# EAGLE design esp-socket-3 (EAGLE 7.3.0)
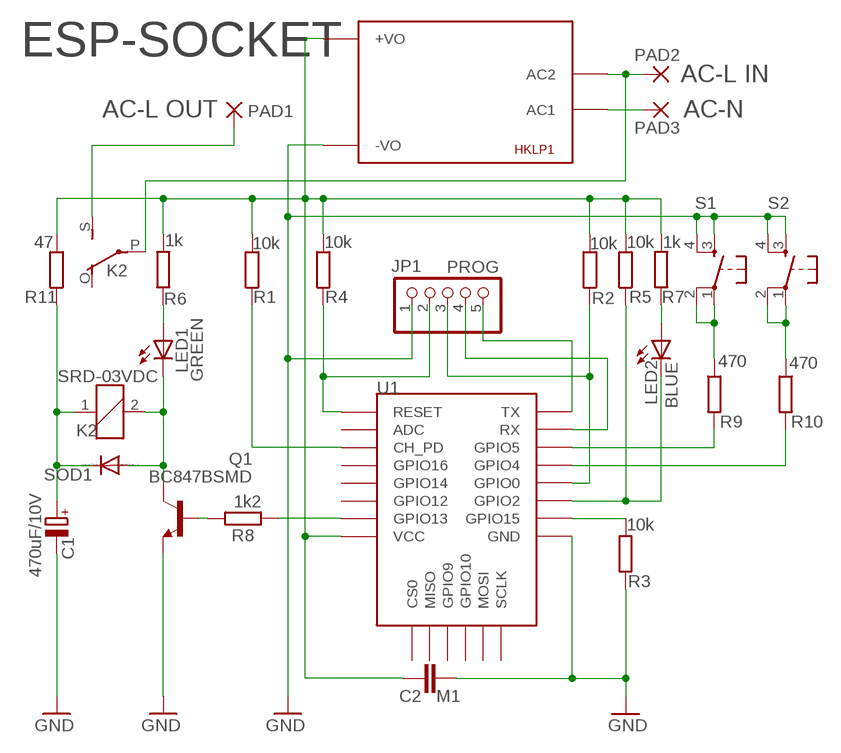
[diagram p0: schematic, sheet 1]

## Parts
C1  470uF/10V  CPOL-EUE3.5-8  [E3,5-8]
C2  M1  C-EUC1206  [C1206]
HKLP1  HKLPM01  [HKLPM01]
JP1  PROG  PINHD-1X5  [1X05]
K2  SRD-03VDC  G5LG5L-B  [G5L-B]
LED1  GREEN  LED3MM  [LED3MM]
LED2  BLUE  LED3MM  [LED3MM]
PAD1  3,17/1,1  [3,17/1,1]
PAD2  3,17/1,1  [3,17/1,1]
PAD3  3,17/1,1  [3,17/1,1]
Q1  BC847BSMD  [SOT23]
R1  10k  R-EU_M1206  [M1206]
R2  10k  R-EU_M1206  [M1206]
R3  10k  R-EU_M1206  [M1206]
R4  10k  R-EU_M1206  [M1206]
R5  10k  R-EU_M1206  [M1206]
R6  1k  R-EU_M1206  [M1206]
R7  1k  R-EU_M1206  [M1206]
R8  1k2  R-EU_M1206  [M1206]
R9  470  R-EU_M1206  [M1206]
R10  470  R-EU_M1206  [M1206]
R11  47  R-EU_0207/10B  [0207/10B]
S1  DTS-6  [DTS-6]
S2  DTS-6  [DTS-6]
SOD1  DIODE-MELF-MLL41  [MELF-MLL41]
U1  ESP12ESMD  [ESP12E-SMD]

## Nets
3V3: C2.1 HKLP1.P$4(+VO) R1.2 R2.2 R4.2 R5.2 R6.2 R7.2 R11.2 U1.VCC
GND: C1.- C2.2 HKLP1.P$3(-VO) JP1.1 Q1.2(E) R3.1 S1.3 S1.4 S2.3 S2.4 U1.GND
N$1: Q1.1(B) R8.2
N$2: C1.+ K2.1 R11.1 SOD1.C
N$3: R8.1 U1.GPIO13
N$4: K2.2 LED1.K(C) Q1.3(C) SOD1.A
N$5: R1.1 U1.CH_PD
N$6: HKLP1.P$2(AC2) K2.P(2:P) PAD2.1(P)
N$8: K2.S(2:S) PAD1.1(P)
N$9: LED2.K(C) R5.1 U1.GPIO2
N$10: R3.2 U1.GPIO15
N$11: JP1.2 R4.1 U1.RESET
N$12: R9.1 S1.1 S1.2
N$13: R10.1 S2.1 S2.2
N$14: LED2.A R7.1
N$15: LED1.A R6.1
N$16: JP1.3 R2.1 U1.GPIO0
N$17: JP1.5 U1.TXD0(TX)
N$18: R9.2 U1.GPIO5
N$19: R10.2 U1.GPIO4
N$20: JP1.4 U1.RXD0(RX)
N$21: HKLP1.P$1(AC1) PAD3.1(P)
Unconnected: K2.O(2:O) U1.ADC U1.CS0 U1.GPIO9 U1.GPIO10 U1.GPIO12 U1.GPIO14 U1.GPIO16 U1.MISO U1.MOSI U1.SCLK

## Notes on the sheet
- ESP-SOCKET
- AC-L IN
- AC-L OUT | AC-N

## Library data of the parts
C1 = rcl:CPOL-EU: POLARIZED CAPACITOR, European symbol
C2 = rcl:C-EU: CAPACITOR, European symbol
HKLP1 = HKLPM01:HKLPM01
JP1 = pinhead:PINHD-1X5: PIN HEADER
K2 = relay:G5L: RELAY 1 x switch, 10 A/120 V AC, 8 A/30 V ADC, Omron
LED1 LED2 = led:LED: LED OSRAM: - CHIPLED LG R971, LG N971, LY N971, LG Q971, LY Q971, LO R971, LY R971 LH N974, LH R974 LS Q976, LO Q976, LY Q976 LO Q996 - Hyper CHIPLED LW Q18S LB Q993, LB Q99A, LB R99A - SideLED LS A670, LO A670, LY A670, LG A670, LP A670 LB A673, LV A673, LT A673, LW A673 LH A674 LY A675 LS A676, LA A676, LO A676, LY A676, LW A676 LS A679, LY A679, LG A679 - Hyper Micro SIDELED® LS Y876, LA Y876, LO Y876, LY Y876 LT Y87S - SmartLED LW L88C, LW L88S LB L89C, LB L89S, LG L890 LS L89K, LO L89K, LY L89K LS L896, LA L896, LO L896, LY L896 - TOPLED LS T670, LO T670, LY T670, LG T670, LP T670 LSG T670, LSP T670, LSY T670, LOP T670, LYG T670 LG T671, LOG T671, LSG T671 LB T673, LV T673, LT T673, LW T673 LH T674 LS T676, LA T676, LO T676, LY T676, LB T676, LH T676, LSB T676, LW T676 LB T67C, LV T67C, LT T67C, LS T67K, LO T67K, LY T67K, LW E67C LS E67B, LA E67B, LO E67B, LY E67B, LB E67C, LV E67C, LT E67C LW T67C LS T679, LY T679, LG T679 LS T770, LO T770, LY T770, LG T770, LP T770 LB T773, LV T773, LT T773, LW T773 LH T774 LS E675, LA E675, LY E675, LS T675 LS T776, LA T776, LO T776, LY T776, LB T776 LHGB T686 LT T68C, LB T68C - Hyper Mini TOPLED® LB M676 - Mini TOPLED Santana® LG M470 LS M47K, LO M47K, LY M47K Source: http://www.osram.convergy.de LUXEON: - LUMILED® LXK2-PW12-R00, LXK2-PW12-S00, LXK2-PW14-U00, LXK2-PW14-V00 LXK2-PM12-R00, LXK2-PM12-S00, LXK2-PM14-U00 LXK2-PE12-Q00, LXK2-PE12-R00, LXK2-PE12-S00, LXK2-PE14-T00, LXK2-PE14-U00 LXK2-PB12-K00, LXK2-PB12-L00, LXK2-PB12-M00, LXK2-PB14-N00, LXK2-PB14-P00, LXK2-PB14-Q00 LXK2-PR12-L00, LXK2-PR12-M00, LXK2-PR14-Q00, LXK2-PR14-R00 LXK2-PD12-Q00, LXK2-PD12-R00, LXK2-PD12-S00 LXK2-PH12-R00, LXK2-PH12-S00 LXK2-PL12-P00, LXK2-PL12-Q00, LXK2-PL12-R00 Source: www.luxeon.com KINGBRIGHT: KA-3528ASYC Source: www.kingbright.com
PAD1-PAD3 = wirepad:3,17/1,1: THROUGH-HOLE PAD
Q1 = transistor-npn:BC847*: NPN Transistor
R1-R11 = rcl:R-EU_: RESISTOR, European symbol
S1 S2 = switch-tact:DTS-6
SOD1 = diode:DIODE-: DIODE
U1 = esp8266modules:ESP12E: ESP12E Module

## Board
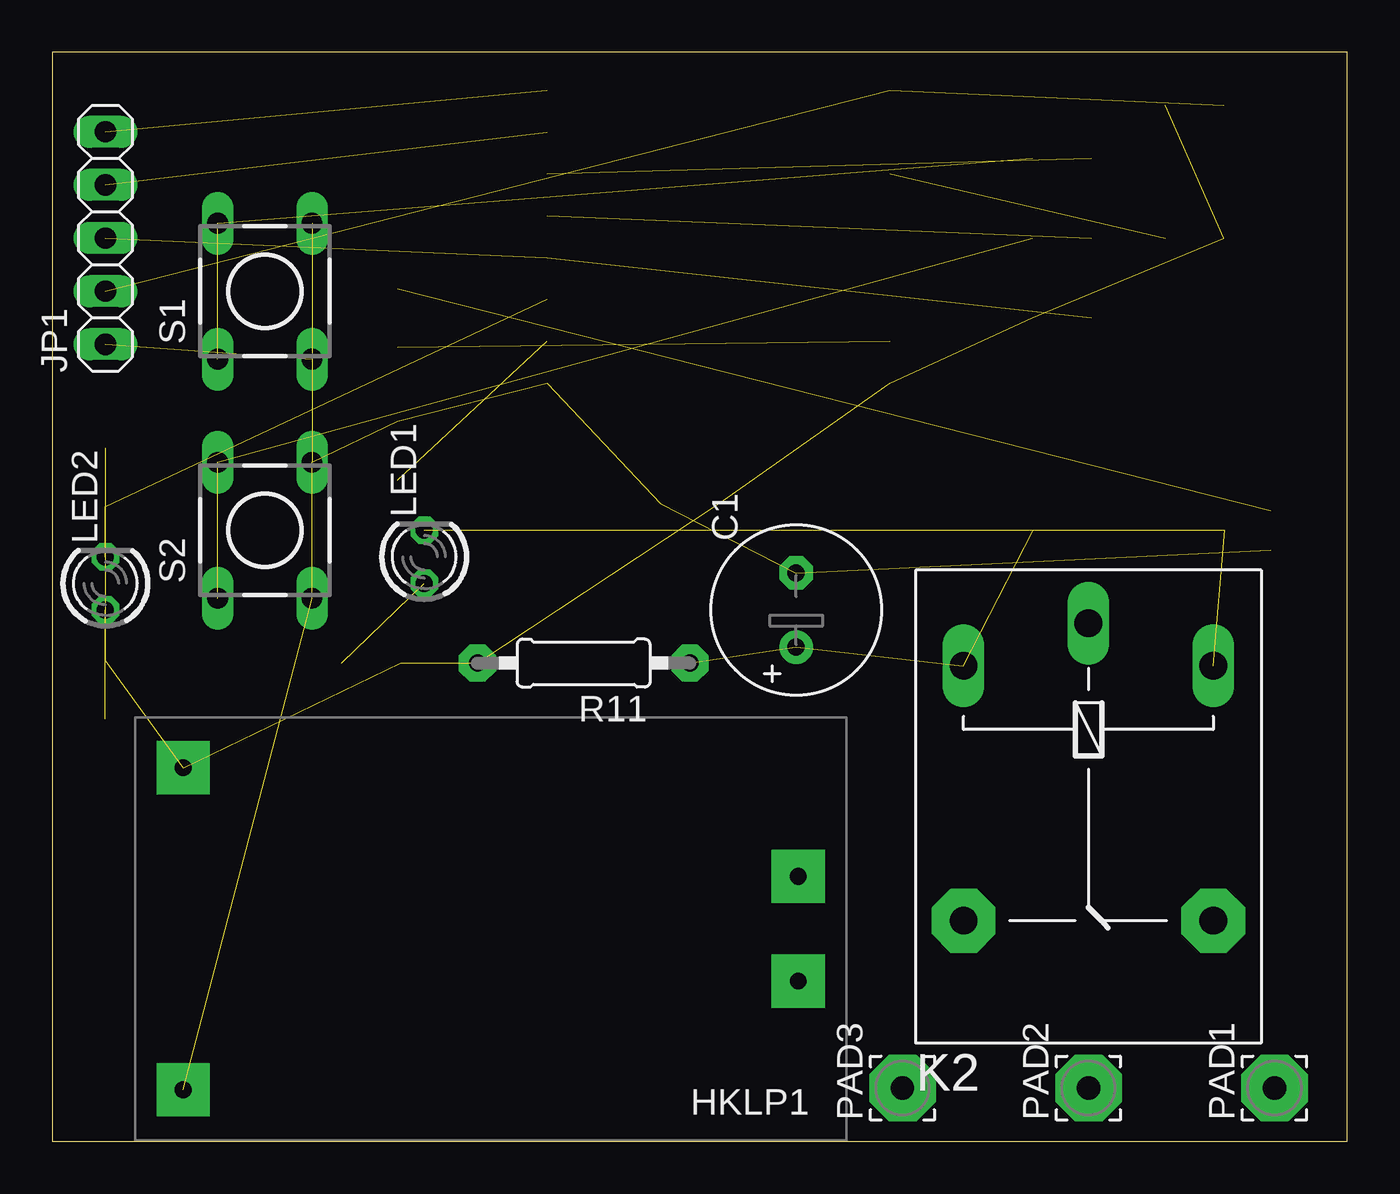
[diagram p1: board, top side]
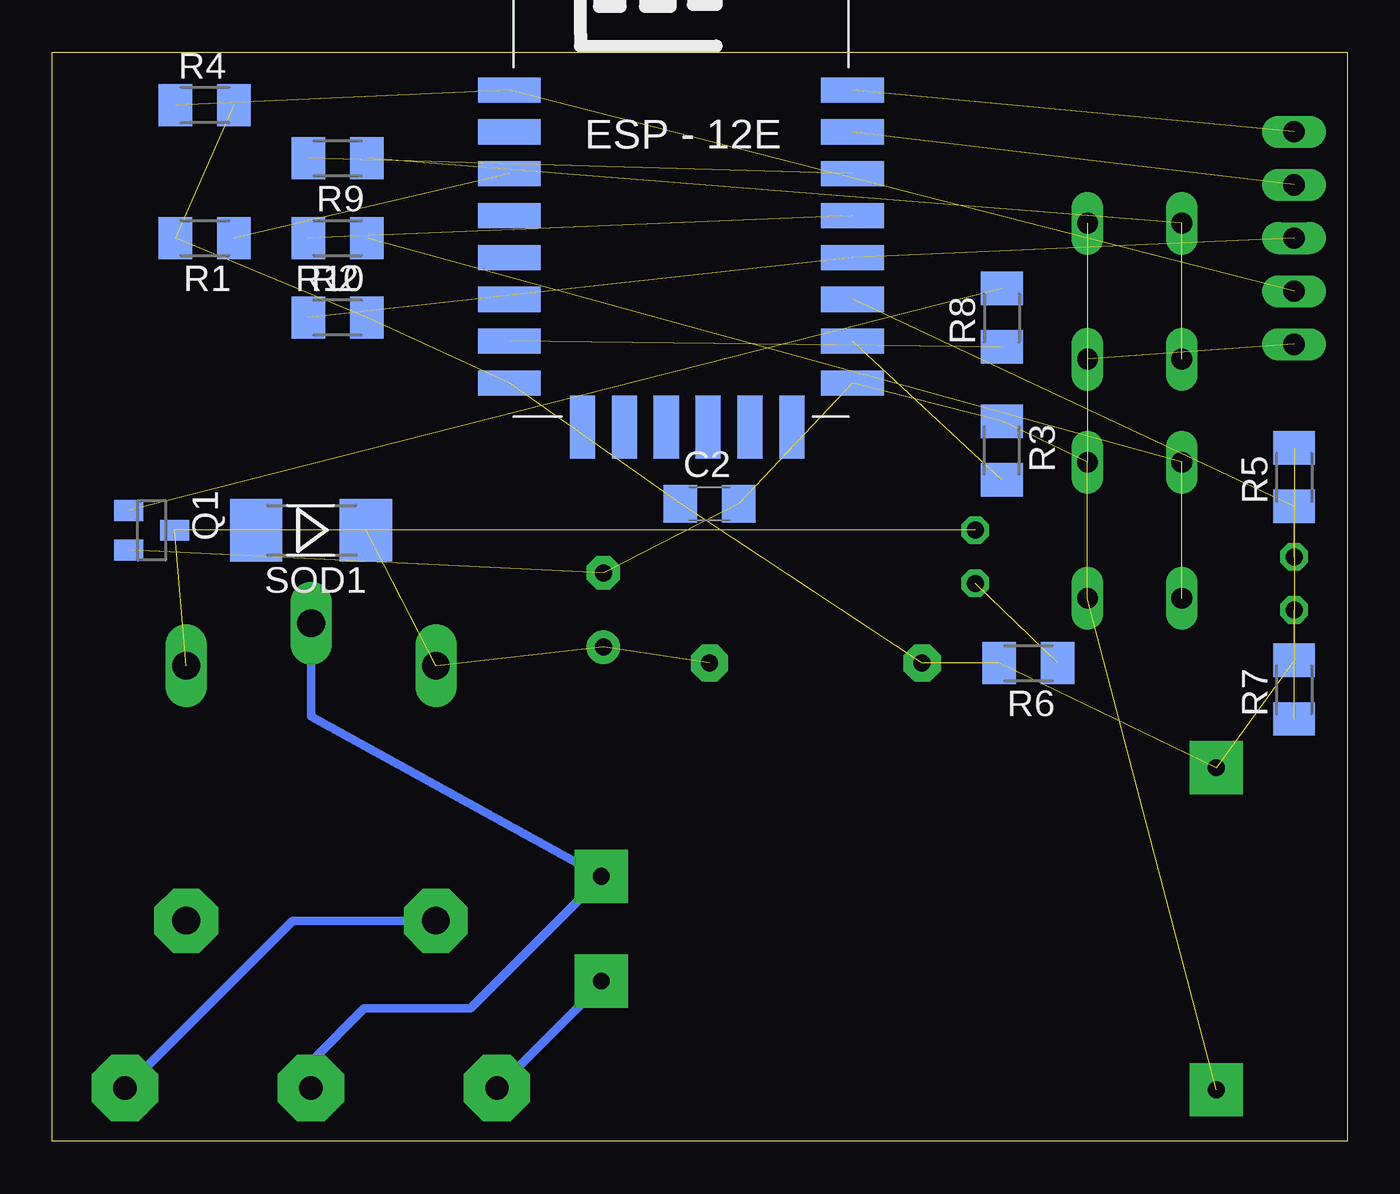
[diagram p2: board, bottom side, seen from below]

Size 61.9 x 52.06 mm. Coordinates in mm from the lower left corner, seen from the top.
Outline: 0,0 61.9,0 61.9,52.06 0,52.06 0,0
Copper layers (1*16): Top 0.035mm / dielectric 1.5mm / Bottom 0.035mm
Design rules "default": minimum track width 10mil, minimum drill 24mil, track to track 8mil, track to pad 8mil, pad to pad 8mil, via to via 8mil, smd to smd 8mil, copper to edge 40mil, drill to drill 8mil, minimum pad ring 10mil, minimum via ring 8mil, stop-mask expansion 4mil, vias tented up to drill 0mil, thermal gap 10mil

### Footprints (pad centres in the part's own frame; a part is rotated, then mirrored left to right if it is on the bottom)
E3,5-8 = drill 0.813 pad 1.6: + -1.778,0 | drill 0.813 pad 1.6 octagon: - 1.778,0
C1206 = smd 1.6 x 1.8: 1 -1.4,0; 2 1.4,0
HKLPM01 = drill 0.8 pad 2.54 square: P$1 -14.7,2.5; P$2 -14.7,-2.5; P$3 14.7,7.7; P$4 14.7,-7.7
1X05 = drill 1.016 long: 1 -5.08,0; 2 -2.54,0; 3 0,0; 4 2.54,0; 5 5.08,0
G5L-B = drill 1.321 long: 1 -7.493,-5.969; 2 -7.493,5.969; P -9.525,0 | drill 1.321 pad 3.048 octagon: O 4.699,5.969; S 4.699,-5.969
LED3MM = drill 0.813 octagon: A -1.27,0; K 1.27,0
3,17/1,1 = drill 1.118 pad 3.175 octagon: 1 0,0
SOT23 = smd 1 x 1.4: 1 -0.95,-1.1; 2 0.95,-1.1; 3 0,1.1
M1206 = smd 1.6 x 2: 1 -1.4,0; 2 1.4,0
0207/10B = drill 0.813 pad 1.778 octagon: 1 -5.08,0; 2 5.08,0
DTS-6 = drill 1 long: 1 -3.25,2.25; 2 3.25,2.25; 3 -3.25,-2.25; 4 3.25,-2.25
MELF-MLL41 = smd 2.5 x 3: A 2.625,0; C -2.625,0
ESP12E-SMD = smd 3 x 1.2: ADC -8.3,3.8; CH_PD -8.3,1.8; GND 8.1,-8.2; GPIO0 8.1,-2.2; GPIO2 8.1,-4.2; GPIO4 8.1,-0.2; GPIO5 8.1,1.8; GPIO12 -8.3,-4.2; GPIO13 -8.3,-6.2; GPIO14 -8.3,-2.2; GPIO15 8.1,-6.2; GPIO16 -8.3,-0.2; RESET -8.3,5.8; RXD0 8.1,3.8; TXD0 8.1,5.8; VCC -8.3,-8.2 | smd 1.2 x 3: CS0 -4.8,-10.3; GPIO9 -0.8,-10.3; GPIO10 1.2,-10.3; MISO -2.8,-10.3; MOSI 3.2,-10.3; SCLK 5.2,-10.3

### Placement (x,y rotation side)
C1  35.56,25.4 90 top
C2  30.48,30.48 0 bottom
HKLP1  20.95,10.16 180 top
JP1  2.54,43.18 90 top
K2  49.53,15.24 270 top
LED1  17.78,27.94 90 top
LED2  2.54,26.67 90 top
PAD1  58.42,2.54 90 top
PAD2  49.53,2.54 90 top
PAD3  40.64,2.54 90 top
Q1  57.15,29.21 270 bottom
R1  54.61,43.18 180 bottom
R2  48.26,39.37 0 bottom
R3  16.51,33.02 270 bottom
R4  54.61,49.53 0 bottom
R5  2.54,31.75 90 bottom
R6  15.24,22.86 180 bottom
R7  2.54,21.59 90 bottom
R8  16.51,39.37 90 bottom
R9  48.26,46.99 180 bottom
R10  48.26,43.18 180 bottom
R11  25.4,22.86 180 top
S1  10.16,40.64 90 top
S2  10.16,29.21 90 top
SOD1  49.53,29.21 180 bottom
U1  31.75,44.45 0 bottom

### Tracks (layer width: path | path; a pad name or v marks a point on that pad's centre or on a via)
3V3  (9 unrouted)
GND  (10 unrouted)
N$1  (1 unrouted)
N$2  (3 unrouted)
N$3  (1 unrouted)
N$4  (3 unrouted)
N$5  (1 unrouted)
N$6
  Bottom 0.406: K2.P 49.53,20.32 HKLP1.P$2 35.66,12.61 41.91,6.35 46.99,6.35 49.53,3.81 PAD2.1
N$8
  Bottom 0.406: K2.S 50.42,10.54 PAD1.1
N$9  (2 unrouted)
N$10  (1 unrouted)
N$11  (2 unrouted)
N$12  (2 unrouted)
N$13  (2 unrouted)
N$14  (1 unrouted)
N$15  (1 unrouted)
N$16  (2 unrouted)
N$17  (1 unrouted)
N$18  (1 unrouted)
N$19  (1 unrouted)
N$20  (1 unrouted)
N$21
  Bottom 0.406: HKLP1.P$1 35.66,7.53 PAD3.1